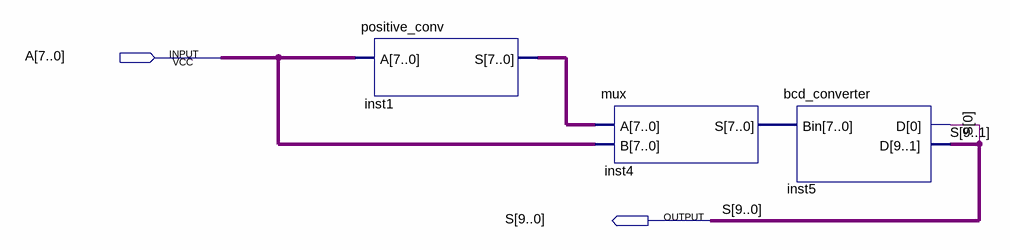
[diagram p0: schematic sheet]
// Quartus schematic bcd_converter_wrapper.bdf as structural Verilog: 3 symbols, 2 pins
module bcd_converter_wrapper (
  input  [7:0] A,
  output [9:0] S
);

  wire [7:0] inst1_s, inst4_s;

  positive_conv inst1 (.A(A), .S(inst1_s));
  mux inst4 (.A(inst1_s), .B(A), .S(inst4_s));
  bcd_converter inst5 (.Bin(inst4_s), .D(S));
endmodule
